# Altium schematic sheet P01_Top Level.SchDoc
size C; SheetNumber: 1; SheetTotal: 3
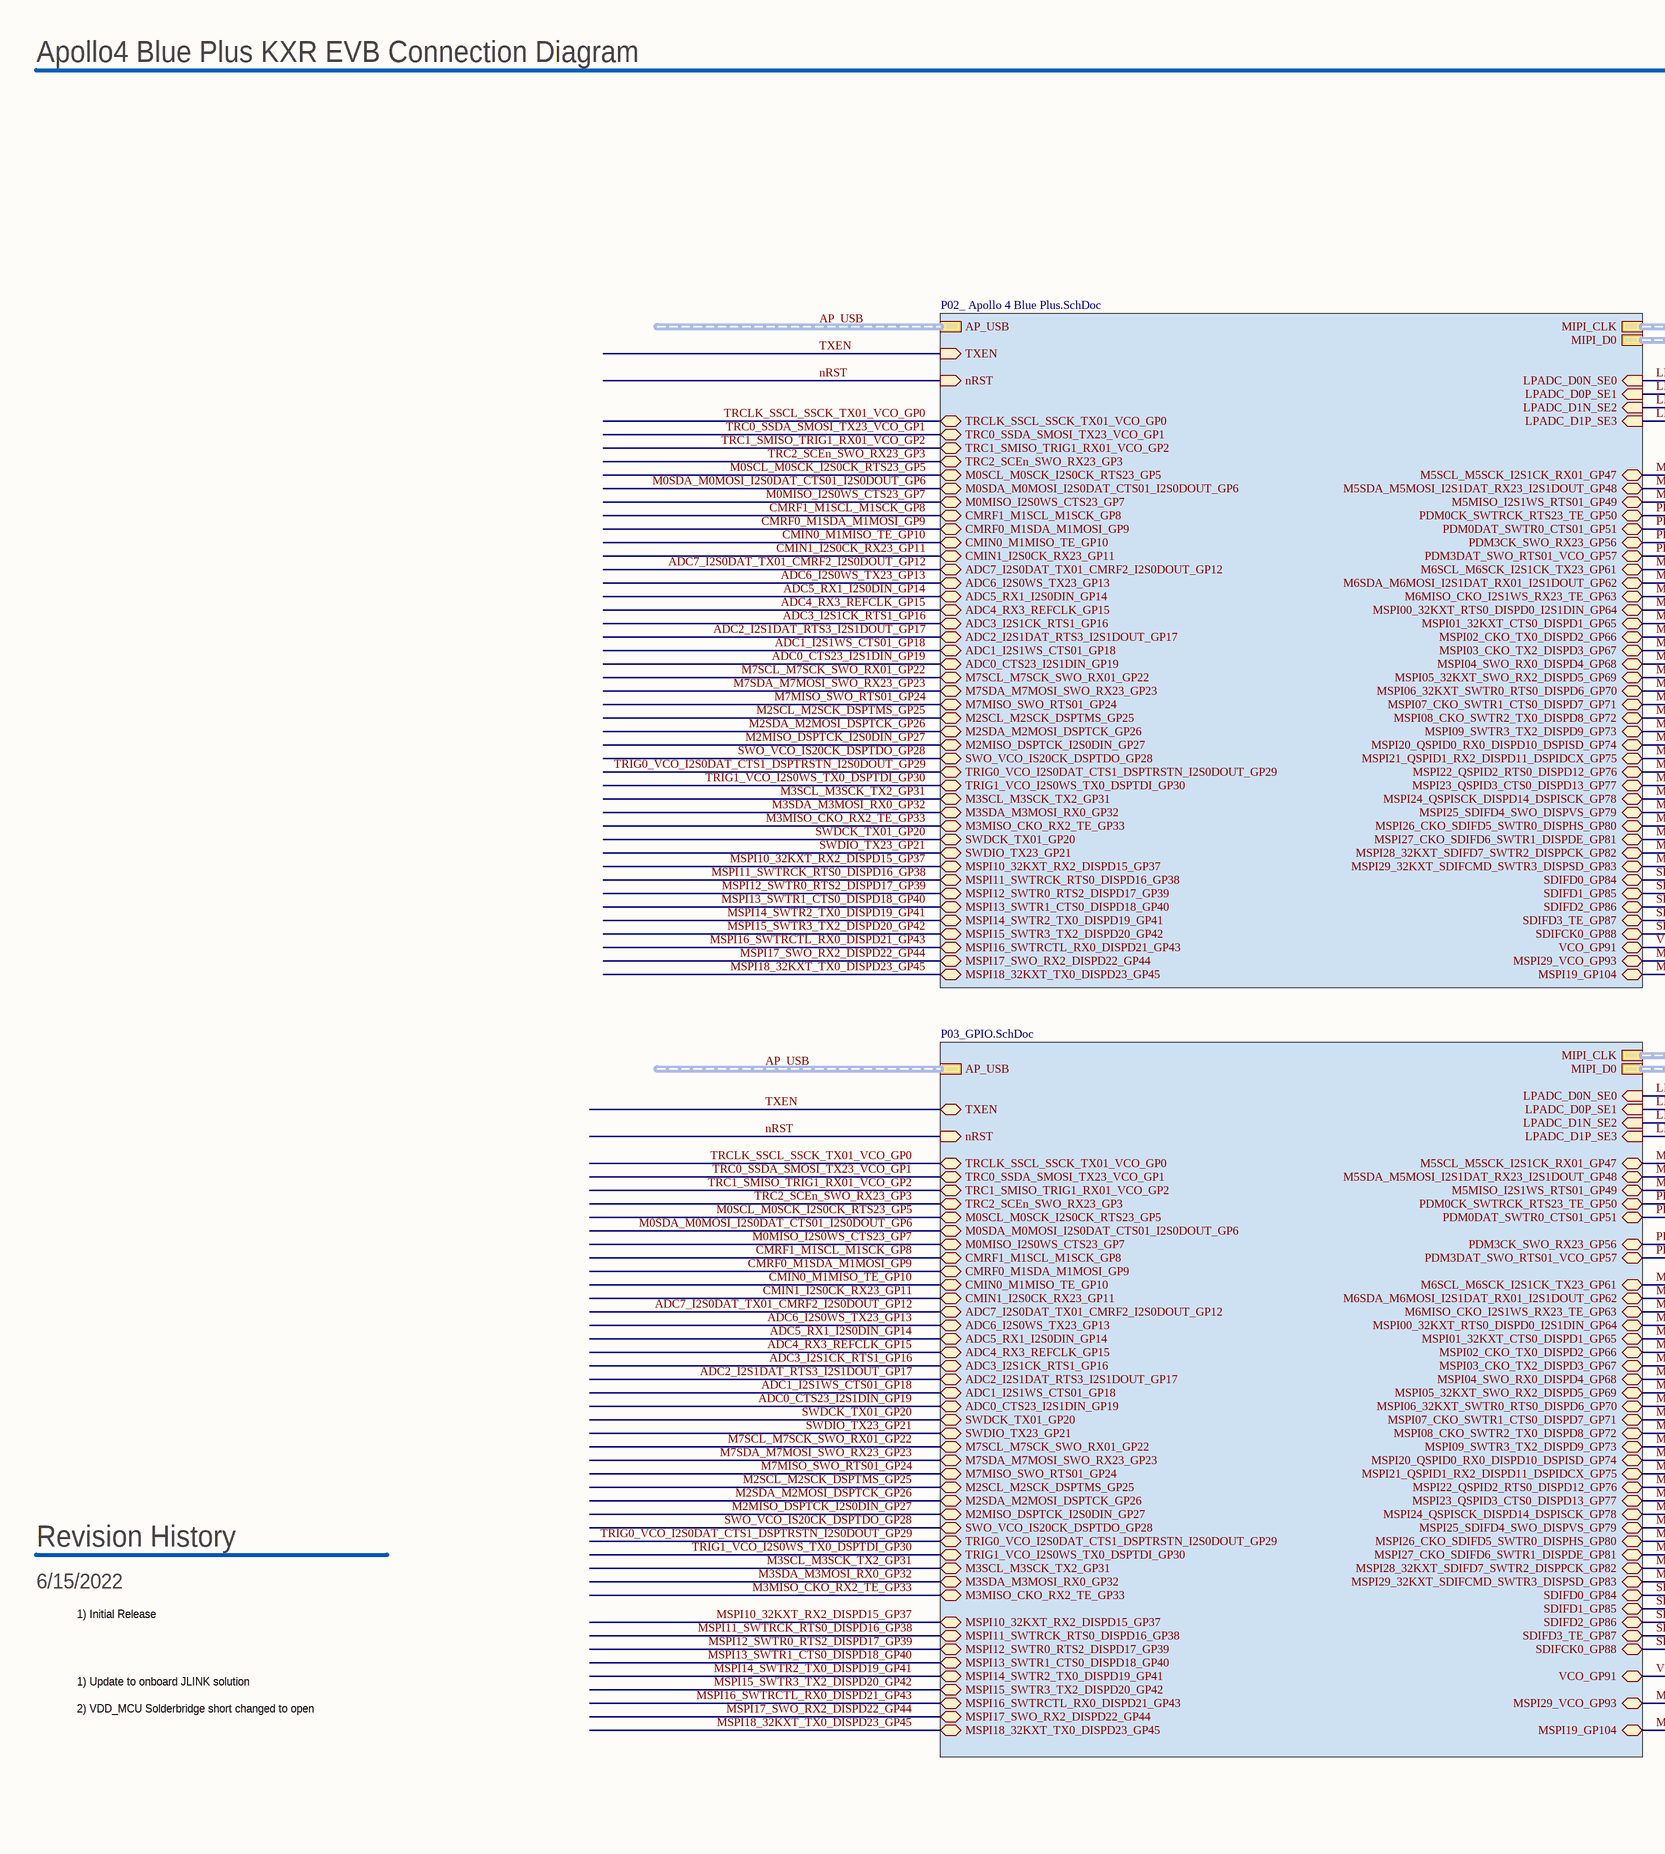
[diagram p0: P01_Top Level.SchDoc, left]
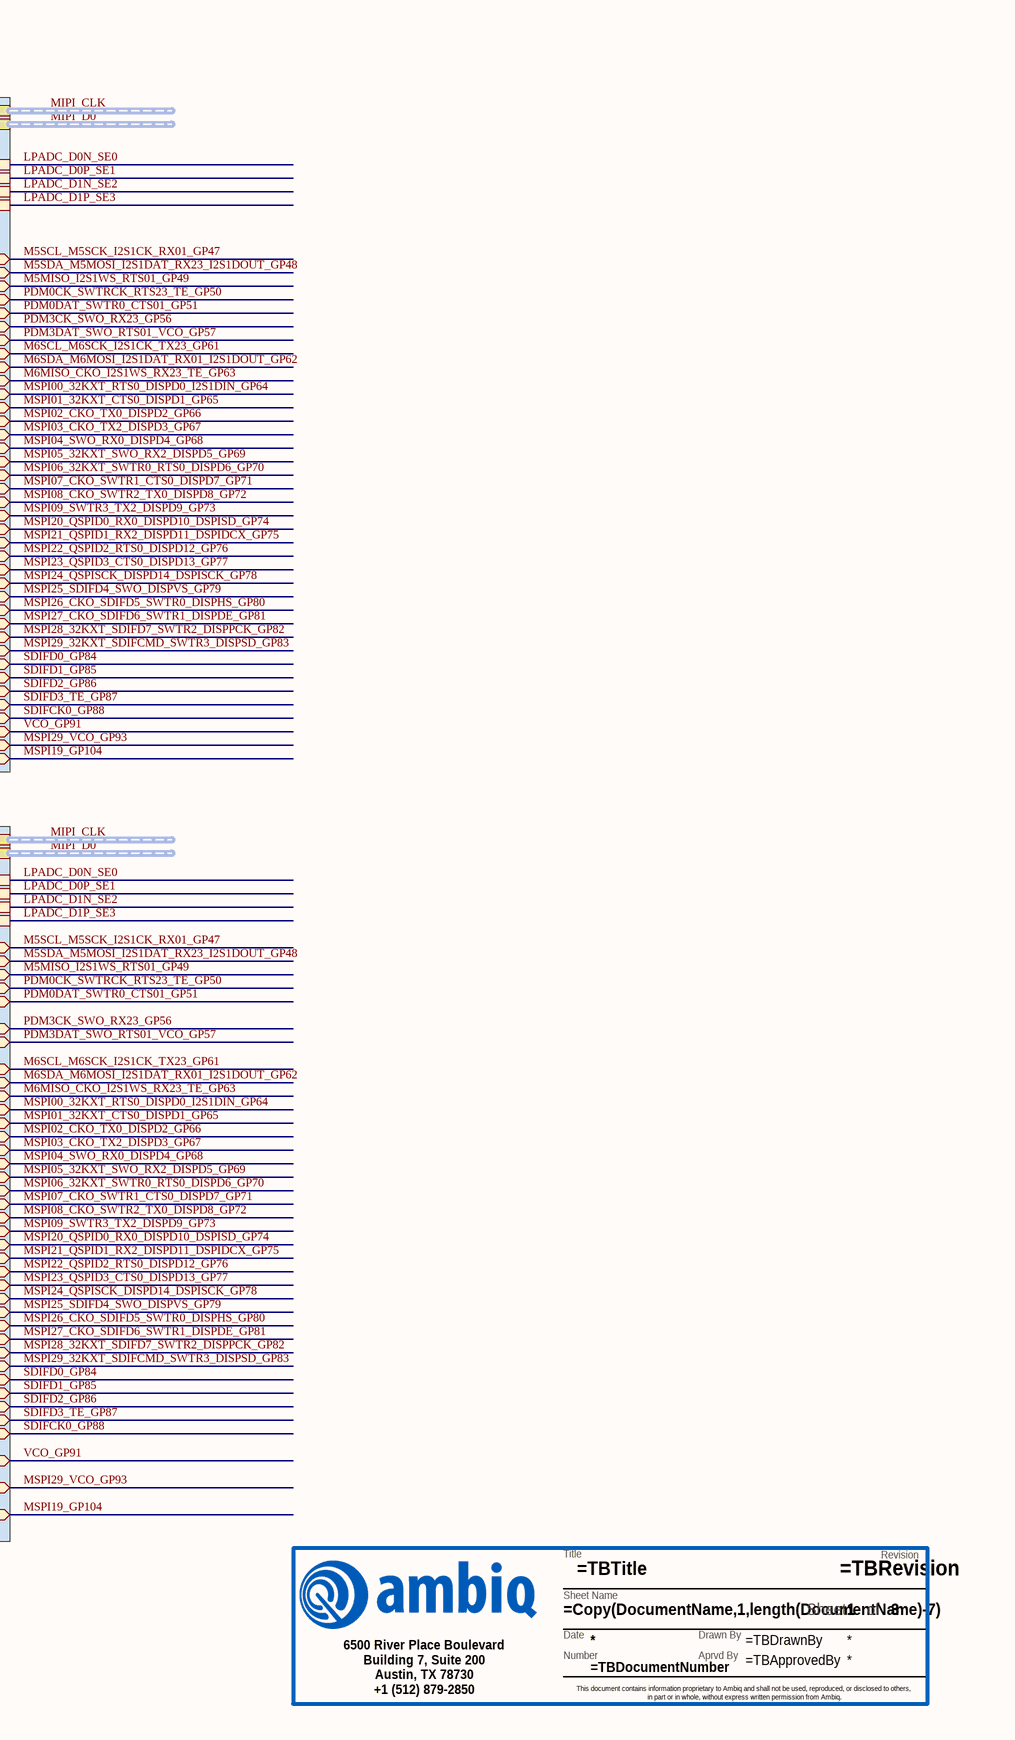
[diagram p1: P01_Top Level.SchDoc, right]

## Parts
?  TitleBlock  (value not drawn)  (graphical)

## Sub-sheets
Apollo4B = P02_ Apollo 4 Blue Plus.SchDoc: LPADC_D0P_SE1 (in), LPADC_D0N_SE0 (in), LPADC_D1P_SE3 (in), LPADC_D1N_SE2 (in), MIPI_CLK (harness MIPI), MIPI_D0 (harness MIPI), TRCLK_SSCL_SSCK_TX01_VCO_GP0 (bidir), TRC0_SSDA_SMOSI_TX23_VCO_GP1 (bidir), TRC1_SMISO_TRIG1_RX01_VCO_GP2 (bidir), TRC2_SCEn_SWO_RX23_GP3 (bidir), M0SCL_M0SCK_I2S0CK_RTS23_GP5 (bidir), M0SDA_M0MOSI_I2S0DAT_CTS01_I2S0DOUT_GP6 (bidir), M0MISO_I2S0WS_CTS23_GP7 (bidir), CMRF1_M1SCL_M1SCK_GP8 (bidir), CMRF0_M1SDA_M1MOSI_GP9 (bidir), CMIN0_M1MISO_TE_GP10 (bidir), CMIN1_I2S0CK_RX23_GP11 (bidir), ADC7_I2S0DAT_TX01_CMRF2_I2S0DOUT_GP12 (bidir), ADC6_I2S0WS_TX23_GP13 (bidir), ADC5_RX1_I2S0DIN_GP14 (bidir), ADC4_RX3_REFCLK_GP15 (bidir), ADC3_I2S1CK_RTS1_GP16 (bidir), ADC2_I2S1DAT_RTS3_I2S1DOUT_GP17 (bidir), ADC1_I2S1WS_CTS01_GP18 (bidir), ADC0_CTS23_I2S1DIN_GP19 (bidir), M7SCL_M7SCK_SWO_RX01_GP22 (bidir), M7SDA_M7MOSI_SWO_RX23_GP23 (bidir), M7MISO_SWO_RTS01_GP24 (bidir), M2SCL_M2SCK_DSPTMS_GP25 (bidir), M2SDA_M2MOSI_DSPTCK_GP26 (bidir), M2MISO_DSPTCK_I2S0DIN_GP27 (bidir), SWO_VCO_IS20CK_DSPTDO_GP28 (bidir), TRIG0_VCO_I2S0DAT_CTS1_DSPTRSTN_I2S0DOUT_GP29 (bidir), TRIG1_VCO_I2S0WS_TX0_DSPTDI_GP30 (bidir), M3SCL_M3SCK_TX2_GP31 (bidir), M3SDA_M3MOSI_RX0_GP32 (bidir), M3MISO_CKO_RX2_TE_GP33 (bidir), SWDCK_TX01_GP20 (bidir), SWDIO_TX23_GP21 (bidir), MSPI10_32KXT_RX2_DISPD15_GP37 (bidir), MSPI11_SWTRCK_RTS0_DISPD16_GP38 (bidir), MSPI12_SWTR0_RTS2_DISPD17_GP39 (bidir), MSPI13_SWTR1_CTS0_DISPD18_GP40 (bidir), MSPI14_SWTR2_TX0_DISPD19_GP41 (bidir), MSPI15_SWTR3_TX2_DISPD20_GP42 (bidir), MSPI16_SWTRCTL_RX0_DISPD21_GP43 (bidir), MSPI17_SWO_RX2_DISPD22_GP44 (bidir), MSPI18_32KXT_TX0_DISPD23_GP45 (bidir), MSPI27_CKO_SDIFD6_SWTR1_DISPDE_GP81 (bidir), MSPI28_32KXT_SDIFD7_SWTR2_DISPPCK_GP82 (bidir), MSPI29_32KXT_SDIFCMD_SWTR3_DISPSD_GP83 (bidir), SDIFD0_GP84 (bidir), SDIFD1_GP85 (bidir), SDIFD2_GP86 (bidir), SDIFD3_TE_GP87 (bidir), SDIFCK0_GP88 (bidir), VCO_GP91 (bidir), MSPI29_VCO_GP93 (bidir), MSPI19_GP104 (bidir), MSPI00_32KXT_RTS0_DISPD0_I2S1DIN_GP64 (bidir), MSPI01_32KXT_CTS0_DISPD1_GP65 (bidir), MSPI02_CKO_TX0_DISPD2_GP66 (bidir), MSPI03_CKO_TX2_DISPD3_GP67 (bidir), MSPI04_SWO_RX0_DISPD4_GP68 (bidir), MSPI05_32KXT_SWO_RX2_DISPD5_GP69 (bidir), MSPI06_32KXT_SWTR0_RTS0_DISPD6_GP70 (bidir), MSPI07_CKO_SWTR1_CTS0_DISPD7_GP71 (bidir), MSPI08_CKO_SWTR2_TX0_DISPD8_GP72 (bidir), MSPI09_SWTR3_TX2_DISPD9_GP73 (bidir), MSPI20_QSPID0_RX0_DISPD10_DSPISD_GP74 (bidir), MSPI21_QSPID1_RX2_DISPD11_DSPIDCX_GP75 (bidir), MSPI22_QSPID2_RTS0_DISPD12_GP76 (bidir), MSPI23_QSPID3_CTS0_DISPD13_GP77 (bidir), MSPI24_QSPISCK_DISPD14_DSPISCK_GP78 (bidir), MSPI25_SDIFD4_SWO_DISPVS_GP79 (bidir), MSPI26_CKO_SDIFD5_SWTR0_DISPHS_GP80 (bidir), M5SCL_M5SCK_I2S1CK_RX01_GP47 (bidir), M5SDA_M5MOSI_I2S1DAT_RX23_I2S1DOUT_GP48 (bidir), M5MISO_I2S1WS_RTS01_GP49 (bidir), PDM0CK_SWTRCK_RTS23_TE_GP50 (bidir), PDM0DAT_SWTR0_CTS01_GP51 (bidir), PDM3CK_SWO_RX23_GP56 (bidir), PDM3DAT_SWO_RTS01_VCO_GP57 (bidir), M6SCL_M6SCK_I2S1CK_TX23_GP61 (bidir), M6SDA_M6MOSI_I2S1DAT_RX01_I2S1DOUT_GP62 (bidir), M6MISO_CKO_I2S1WS_RX23_TE_GP63 (bidir), AP_USB (harness USB), TXEN (in), nRST (in)
GPIO = P03_GPIO.SchDoc: MIPI_CLK (harness MIPI), MIPI_D0 (harness MIPI), M0SCL_M0SCK_I2S0CK_RTS23_GP5 (bidir), M0SDA_M0MOSI_I2S0DAT_CTS01_I2S0DOUT_GP6 (bidir), M0MISO_I2S0WS_CTS23_GP7 (bidir), CMRF1_M1SCL_M1SCK_GP8 (bidir), CMRF0_M1SDA_M1MOSI_GP9 (bidir), CMIN0_M1MISO_TE_GP10 (bidir), CMIN1_I2S0CK_RX23_GP11 (bidir), ADC7_I2S0DAT_TX01_CMRF2_I2S0DOUT_GP12 (bidir), ADC6_I2S0WS_TX23_GP13 (bidir), ADC5_RX1_I2S0DIN_GP14 (bidir), ADC4_RX3_REFCLK_GP15 (bidir), ADC3_I2S1CK_RTS1_GP16 (bidir), ADC2_I2S1DAT_RTS3_I2S1DOUT_GP17 (bidir), ADC1_I2S1WS_CTS01_GP18 (bidir), ADC0_CTS23_I2S1DIN_GP19 (bidir), M7SCL_M7SCK_SWO_RX01_GP22 (bidir), M7SDA_M7MOSI_SWO_RX23_GP23 (bidir), M7MISO_SWO_RTS01_GP24 (bidir), M2SCL_M2SCK_DSPTMS_GP25 (bidir), M2SDA_M2MOSI_DSPTCK_GP26 (bidir), M2MISO_DSPTCK_I2S0DIN_GP27 (bidir), SWO_VCO_IS20CK_DSPTDO_GP28 (bidir), TRIG0_VCO_I2S0DAT_CTS1_DSPTRSTN_I2S0DOUT_GP29 (bidir), TRIG1_VCO_I2S0WS_TX0_DSPTDI_GP30 (bidir), M3SCL_M3SCK_TX2_GP31 (bidir), M3SDA_M3MOSI_RX0_GP32 (bidir), M3MISO_CKO_RX2_TE_GP33 (bidir), MSPI10_32KXT_RX2_DISPD15_GP37 (bidir), MSPI11_SWTRCK_RTS0_DISPD16_GP38 (bidir), MSPI12_SWTR0_RTS2_DISPD17_GP39 (bidir), MSPI13_SWTR1_CTS0_DISPD18_GP40 (bidir), MSPI14_SWTR2_TX0_DISPD19_GP41 (bidir), MSPI15_SWTR3_TX2_DISPD20_GP42 (bidir), MSPI16_SWTRCTL_RX0_DISPD21_GP43 (bidir), MSPI17_SWO_RX2_DISPD22_GP44 (bidir), MSPI18_32KXT_TX0_DISPD23_GP45 (bidir), MSPI27_CKO_SDIFD6_SWTR1_DISPDE_GP81 (bidir), MSPI28_32KXT_SDIFD7_SWTR2_DISPPCK_GP82 (bidir), MSPI29_32KXT_SDIFCMD_SWTR3_DISPSD_GP83 (bidir), SDIFD0_GP84 (bidir), SDIFD1_GP85 (bidir), SDIFD2_GP86 (bidir), SDIFD3_TE_GP87 (bidir), SDIFCK0_GP88 (bidir), VCO_GP91 (bidir), MSPI29_VCO_GP93 (bidir), MSPI19_GP104 (bidir), MSPI00_32KXT_RTS0_DISPD0_I2S1DIN_GP64 (bidir), MSPI01_32KXT_CTS0_DISPD1_GP65 (bidir), MSPI02_CKO_TX0_DISPD2_GP66 (bidir), MSPI03_CKO_TX2_DISPD3_GP67 (bidir), MSPI04_SWO_RX0_DISPD4_GP68 (bidir), MSPI05_32KXT_SWO_RX2_DISPD5_GP69 (bidir), MSPI06_32KXT_SWTR0_RTS0_DISPD6_GP70 (bidir), MSPI07_CKO_SWTR1_CTS0_DISPD7_GP71 (bidir), MSPI08_CKO_SWTR2_TX0_DISPD8_GP72 (bidir), MSPI09_SWTR3_TX2_DISPD9_GP73 (bidir), MSPI20_QSPID0_RX0_DISPD10_DSPISD_GP74 (bidir), MSPI21_QSPID1_RX2_DISPD11_DSPIDCX_GP75 (bidir), MSPI22_QSPID2_RTS0_DISPD12_GP76 (bidir), MSPI23_QSPID3_CTS0_DISPD13_GP77 (bidir), MSPI24_QSPISCK_DISPD14_DSPISCK_GP78 (bidir), MSPI25_SDIFD4_SWO_DISPVS_GP79 (bidir), MSPI26_CKO_SDIFD5_SWTR0_DISPHS_GP80 (bidir), M5SCL_M5SCK_I2S1CK_RX01_GP47 (bidir), M5SDA_M5MOSI_I2S1DAT_RX23_I2S1DOUT_GP48 (bidir), M5MISO_I2S1WS_RTS01_GP49 (bidir), PDM0CK_SWTRCK_RTS23_TE_GP50 (bidir), PDM0DAT_SWTR0_CTS01_GP51 (bidir), PDM3CK_SWO_RX23_GP56 (bidir), PDM3DAT_SWO_RTS01_VCO_GP57 (bidir), M6SCL_M6SCK_I2S1CK_TX23_GP61 (bidir), M6SDA_M6MOSI_I2S1DAT_RX01_I2S1DOUT_GP62 (bidir), M6MISO_CKO_I2S1WS_RX23_TE_GP63 (bidir), TXEN (bidir), TRCLK_SSCL_SSCK_TX01_VCO_GP0 (bidir), TRC1_SMISO_TRIG1_RX01_VCO_GP2 (bidir), TRC2_SCEn_SWO_RX23_GP3 (bidir), nRST (in), TRC0_SSDA_SMOSI_TX23_VCO_GP1 (bidir), SWDCK_TX01_GP20 (bidir), SWDIO_TX23_GP21 (bidir), AP_USB (harness USB), LPADC_D0P_SE1 (in), LPADC_D0N_SE0 (in), LPADC_D1P_SE3 (in), LPADC_D1N_SE2 (in)

## Nets
ADC0_CTS23_I2S1DIN_GP19: sheet Apollo4B/ADC0_CTS23_I2S1DIN_GP19, sheet GPIO/ADC0_CTS23_I2S1DIN_GP19
ADC1_I2S1WS_CTS01_GP18: sheet Apollo4B/ADC1_I2S1WS_CTS01_GP18, sheet GPIO/ADC1_I2S1WS_CTS01_GP18
ADC2_I2S1DAT_RTS3_I2S1DOUT_GP17: sheet Apollo4B/ADC2_I2S1DAT_RTS3_I2S1DOUT_GP17, sheet GPIO/ADC2_I2S1DAT_RTS3_I2S1DOUT_GP17
ADC3_I2S1CK_RTS1_GP16: sheet Apollo4B/ADC3_I2S1CK_RTS1_GP16, sheet GPIO/ADC3_I2S1CK_RTS1_GP16
ADC4_RX3_REFCLK_GP15: sheet Apollo4B/ADC4_RX3_REFCLK_GP15, sheet GPIO/ADC4_RX3_REFCLK_GP15
ADC5_RX1_I2S0DIN_GP14: sheet Apollo4B/ADC5_RX1_I2S0DIN_GP14, sheet GPIO/ADC5_RX1_I2S0DIN_GP14
ADC6_I2S0WS_TX23_GP13: sheet Apollo4B/ADC6_I2S0WS_TX23_GP13, sheet GPIO/ADC6_I2S0WS_TX23_GP13
ADC7_I2S0DAT_TX01_CMRF2_I2S0DOUT_GP12: sheet Apollo4B/ADC7_I2S0DAT_TX01_CMRF2_I2S0DOUT_GP12, sheet GPIO/ADC7_I2S0DAT_TX01_CMRF2_I2S0DOUT_GP12
CMIN0_M1MISO_TE_GP10: sheet Apollo4B/CMIN0_M1MISO_TE_GP10, sheet GPIO/CMIN0_M1MISO_TE_GP10
CMIN1_I2S0CK_RX23_GP11: sheet Apollo4B/CMIN1_I2S0CK_RX23_GP11, sheet GPIO/CMIN1_I2S0CK_RX23_GP11
CMRF0_M1SDA_M1MOSI_GP9: sheet Apollo4B/CMRF0_M1SDA_M1MOSI_GP9, sheet GPIO/CMRF0_M1SDA_M1MOSI_GP9
CMRF1_M1SCL_M1SCK_GP8: sheet Apollo4B/CMRF1_M1SCL_M1SCK_GP8, sheet GPIO/CMRF1_M1SCL_M1SCK_GP8
LPADC_D0N_SE0: sheet Apollo4B/LPADC_D0N_SE0, sheet GPIO/LPADC_D0N_SE0
LPADC_D0P_SE1: sheet Apollo4B/LPADC_D0P_SE1, sheet GPIO/LPADC_D0P_SE1
LPADC_D1N_SE2: sheet Apollo4B/LPADC_D1N_SE2, sheet GPIO/LPADC_D1N_SE2
LPADC_D1P_SE3: sheet Apollo4B/LPADC_D1P_SE3, sheet GPIO/LPADC_D1P_SE3
M0MISO_I2S0WS_CTS23_GP7: sheet Apollo4B/M0MISO_I2S0WS_CTS23_GP7, sheet GPIO/M0MISO_I2S0WS_CTS23_GP7
M0SCL_M0SCK_I2S0CK_RTS23_GP5: sheet Apollo4B/M0SCL_M0SCK_I2S0CK_RTS23_GP5, sheet GPIO/M0SCL_M0SCK_I2S0CK_RTS23_GP5
M0SDA_M0MOSI_I2S0DAT_CTS01_I2S0DOUT_GP6: sheet Apollo4B/M0SDA_M0MOSI_I2S0DAT_CTS01_I2S0DOUT_GP6, sheet GPIO/M0SDA_M0MOSI_I2S0DAT_CTS01_I2S0DOUT_GP6
M2MISO_DSPTCK_I2S0DIN_GP27: sheet Apollo4B/M2MISO_DSPTCK_I2S0DIN_GP27, sheet GPIO/M2MISO_DSPTCK_I2S0DIN_GP27
M2SCL_M2SCK_DSPTMS_GP25: sheet Apollo4B/M2SCL_M2SCK_DSPTMS_GP25, sheet GPIO/M2SCL_M2SCK_DSPTMS_GP25
M2SDA_M2MOSI_DSPTCK_GP26: sheet Apollo4B/M2SDA_M2MOSI_DSPTCK_GP26, sheet GPIO/M2SDA_M2MOSI_DSPTCK_GP26
M3MISO_CKO_RX2_TE_GP33: sheet Apollo4B/M3MISO_CKO_RX2_TE_GP33, sheet GPIO/M3MISO_CKO_RX2_TE_GP33
M3SCL_M3SCK_TX2_GP31: sheet Apollo4B/M3SCL_M3SCK_TX2_GP31, sheet GPIO/M3SCL_M3SCK_TX2_GP31
M3SDA_M3MOSI_RX0_GP32: sheet Apollo4B/M3SDA_M3MOSI_RX0_GP32, sheet GPIO/M3SDA_M3MOSI_RX0_GP32
M5MISO_I2S1WS_RTS01_GP49: sheet Apollo4B/M5MISO_I2S1WS_RTS01_GP49, sheet GPIO/M5MISO_I2S1WS_RTS01_GP49
M5SCL_M5SCK_I2S1CK_RX01_GP47: sheet Apollo4B/M5SCL_M5SCK_I2S1CK_RX01_GP47, sheet GPIO/M5SCL_M5SCK_I2S1CK_RX01_GP47
M5SDA_M5MOSI_I2S1DAT_RX23_I2S1DOUT_GP48: sheet Apollo4B/M5SDA_M5MOSI_I2S1DAT_RX23_I2S1DOUT_GP48, sheet GPIO/M5SDA_M5MOSI_I2S1DAT_RX23_I2S1DOUT_GP48
M6MISO_CKO_I2S1WS_RX23_TE_GP63: sheet Apollo4B/M6MISO_CKO_I2S1WS_RX23_TE_GP63, sheet GPIO/M6MISO_CKO_I2S1WS_RX23_TE_GP63
M6SCL_M6SCK_I2S1CK_TX23_GP61: sheet Apollo4B/M6SCL_M6SCK_I2S1CK_TX23_GP61, sheet GPIO/M6SCL_M6SCK_I2S1CK_TX23_GP61
M6SDA_M6MOSI_I2S1DAT_RX01_I2S1DOUT_GP62: sheet Apollo4B/M6SDA_M6MOSI_I2S1DAT_RX01_I2S1DOUT_GP62, sheet GPIO/M6SDA_M6MOSI_I2S1DAT_RX01_I2S1DOUT_GP62
M7MISO_SWO_RTS01_GP24: sheet Apollo4B/M7MISO_SWO_RTS01_GP24, sheet GPIO/M7MISO_SWO_RTS01_GP24
M7SCL_M7SCK_SWO_RX01_GP22: sheet Apollo4B/M7SCL_M7SCK_SWO_RX01_GP22, sheet GPIO/M7SCL_M7SCK_SWO_RX01_GP22
M7SDA_M7MOSI_SWO_RX23_GP23: sheet Apollo4B/M7SDA_M7MOSI_SWO_RX23_GP23, sheet GPIO/M7SDA_M7MOSI_SWO_RX23_GP23
MSPI00_32KXT_RTS0_DISPD0_I2S1DIN_GP64: sheet Apollo4B/MSPI00_32KXT_RTS0_DISPD0_I2S1DIN_GP64, sheet GPIO/MSPI00_32KXT_RTS0_DISPD0_I2S1DIN_GP64
MSPI01_32KXT_CTS0_DISPD1_GP65: sheet Apollo4B/MSPI01_32KXT_CTS0_DISPD1_GP65, sheet GPIO/MSPI01_32KXT_CTS0_DISPD1_GP65
MSPI02_CKO_TX0_DISPD2_GP66: sheet Apollo4B/MSPI02_CKO_TX0_DISPD2_GP66, sheet GPIO/MSPI02_CKO_TX0_DISPD2_GP66
MSPI03_CKO_TX2_DISPD3_GP67: sheet Apollo4B/MSPI03_CKO_TX2_DISPD3_GP67, sheet GPIO/MSPI03_CKO_TX2_DISPD3_GP67
MSPI04_SWO_RX0_DISPD4_GP68: sheet Apollo4B/MSPI04_SWO_RX0_DISPD4_GP68, sheet GPIO/MSPI04_SWO_RX0_DISPD4_GP68
MSPI05_32KXT_SWO_RX2_DISPD5_GP69: sheet Apollo4B/MSPI05_32KXT_SWO_RX2_DISPD5_GP69, sheet GPIO/MSPI05_32KXT_SWO_RX2_DISPD5_GP69
MSPI06_32KXT_SWTR0_RTS0_DISPD6_GP70: sheet Apollo4B/MSPI06_32KXT_SWTR0_RTS0_DISPD6_GP70, sheet GPIO/MSPI06_32KXT_SWTR0_RTS0_DISPD6_GP70
MSPI07_CKO_SWTR1_CTS0_DISPD7_GP71: sheet Apollo4B/MSPI07_CKO_SWTR1_CTS0_DISPD7_GP71, sheet GPIO/MSPI07_CKO_SWTR1_CTS0_DISPD7_GP71
MSPI08_CKO_SWTR2_TX0_DISPD8_GP72: sheet Apollo4B/MSPI08_CKO_SWTR2_TX0_DISPD8_GP72, sheet GPIO/MSPI08_CKO_SWTR2_TX0_DISPD8_GP72
MSPI09_SWTR3_TX2_DISPD9_GP73: sheet Apollo4B/MSPI09_SWTR3_TX2_DISPD9_GP73, sheet GPIO/MSPI09_SWTR3_TX2_DISPD9_GP73
MSPI10_32KXT_RX2_DISPD15_GP37: sheet Apollo4B/MSPI10_32KXT_RX2_DISPD15_GP37, sheet GPIO/MSPI10_32KXT_RX2_DISPD15_GP37
MSPI11_SWTRCK_RTS0_DISPD16_GP38: sheet Apollo4B/MSPI11_SWTRCK_RTS0_DISPD16_GP38, sheet GPIO/MSPI11_SWTRCK_RTS0_DISPD16_GP38
MSPI12_SWTR0_RTS2_DISPD17_GP39: sheet Apollo4B/MSPI12_SWTR0_RTS2_DISPD17_GP39, sheet GPIO/MSPI12_SWTR0_RTS2_DISPD17_GP39
MSPI13_SWTR1_CTS0_DISPD18_GP40: sheet Apollo4B/MSPI13_SWTR1_CTS0_DISPD18_GP40, sheet GPIO/MSPI13_SWTR1_CTS0_DISPD18_GP40
MSPI14_SWTR2_TX0_DISPD19_GP41: sheet Apollo4B/MSPI14_SWTR2_TX0_DISPD19_GP41, sheet GPIO/MSPI14_SWTR2_TX0_DISPD19_GP41
MSPI15_SWTR3_TX2_DISPD20_GP42: sheet Apollo4B/MSPI15_SWTR3_TX2_DISPD20_GP42, sheet GPIO/MSPI15_SWTR3_TX2_DISPD20_GP42
MSPI16_SWTRCTL_RX0_DISPD21_GP43: sheet Apollo4B/MSPI16_SWTRCTL_RX0_DISPD21_GP43, sheet GPIO/MSPI16_SWTRCTL_RX0_DISPD21_GP43
MSPI17_SWO_RX2_DISPD22_GP44: sheet Apollo4B/MSPI17_SWO_RX2_DISPD22_GP44, sheet GPIO/MSPI17_SWO_RX2_DISPD22_GP44
MSPI18_32KXT_TX0_DISPD23_GP45: sheet Apollo4B/MSPI18_32KXT_TX0_DISPD23_GP45, sheet GPIO/MSPI18_32KXT_TX0_DISPD23_GP45
MSPI19_GP104: sheet Apollo4B/MSPI19_GP104, sheet GPIO/MSPI19_GP104
MSPI20_QSPID0_RX0_DISPD10_DSPISD_GP74: sheet Apollo4B/MSPI20_QSPID0_RX0_DISPD10_DSPISD_GP74, sheet GPIO/MSPI20_QSPID0_RX0_DISPD10_DSPISD_GP74
MSPI21_QSPID1_RX2_DISPD11_DSPIDCX_GP75: sheet Apollo4B/MSPI21_QSPID1_RX2_DISPD11_DSPIDCX_GP75, sheet GPIO/MSPI21_QSPID1_RX2_DISPD11_DSPIDCX_GP75
MSPI22_QSPID2_RTS0_DISPD12_GP76: sheet Apollo4B/MSPI22_QSPID2_RTS0_DISPD12_GP76, sheet GPIO/MSPI22_QSPID2_RTS0_DISPD12_GP76
MSPI23_QSPID3_CTS0_DISPD13_GP77: sheet Apollo4B/MSPI23_QSPID3_CTS0_DISPD13_GP77, sheet GPIO/MSPI23_QSPID3_CTS0_DISPD13_GP77
MSPI24_QSPISCK_DISPD14_DSPISCK_GP78: sheet Apollo4B/MSPI24_QSPISCK_DISPD14_DSPISCK_GP78, sheet GPIO/MSPI24_QSPISCK_DISPD14_DSPISCK_GP78
MSPI25_SDIFD4_SWO_DISPVS_GP79: sheet Apollo4B/MSPI25_SDIFD4_SWO_DISPVS_GP79, sheet GPIO/MSPI25_SDIFD4_SWO_DISPVS_GP79
MSPI26_CKO_SDIFD5_SWTR0_DISPHS_GP80: sheet Apollo4B/MSPI26_CKO_SDIFD5_SWTR0_DISPHS_GP80, sheet GPIO/MSPI26_CKO_SDIFD5_SWTR0_DISPHS_GP80
MSPI27_CKO_SDIFD6_SWTR1_DISPDE_GP81: sheet Apollo4B/MSPI27_CKO_SDIFD6_SWTR1_DISPDE_GP81, sheet GPIO/MSPI27_CKO_SDIFD6_SWTR1_DISPDE_GP81
MSPI28_32KXT_SDIFD7_SWTR2_DISPPCK_GP82: sheet Apollo4B/MSPI28_32KXT_SDIFD7_SWTR2_DISPPCK_GP82, sheet GPIO/MSPI28_32KXT_SDIFD7_SWTR2_DISPPCK_GP82
MSPI29_32KXT_SDIFCMD_SWTR3_DISPSD_GP83: sheet Apollo4B/MSPI29_32KXT_SDIFCMD_SWTR3_DISPSD_GP83, sheet GPIO/MSPI29_32KXT_SDIFCMD_SWTR3_DISPSD_GP83
MSPI29_VCO_GP93: sheet Apollo4B/MSPI29_VCO_GP93, sheet GPIO/MSPI29_VCO_GP93
nRST: sheet Apollo4B/nRST, sheet GPIO/nRST
PDM0CK_SWTRCK_RTS23_TE_GP50: sheet Apollo4B/PDM0CK_SWTRCK_RTS23_TE_GP50, sheet GPIO/PDM0CK_SWTRCK_RTS23_TE_GP50
PDM0DAT_SWTR0_CTS01_GP51: sheet Apollo4B/PDM0DAT_SWTR0_CTS01_GP51, sheet GPIO/PDM0DAT_SWTR0_CTS01_GP51
PDM3CK_SWO_RX23_GP56: sheet Apollo4B/PDM3CK_SWO_RX23_GP56, sheet GPIO/PDM3CK_SWO_RX23_GP56
PDM3DAT_SWO_RTS01_VCO_GP57: sheet Apollo4B/PDM3DAT_SWO_RTS01_VCO_GP57, sheet GPIO/PDM3DAT_SWO_RTS01_VCO_GP57
SDIFCK0_GP88: sheet Apollo4B/SDIFCK0_GP88, sheet GPIO/SDIFCK0_GP88
SDIFD0_GP84: sheet Apollo4B/SDIFD0_GP84, sheet GPIO/SDIFD0_GP84
SDIFD1_GP85: sheet Apollo4B/SDIFD1_GP85, sheet GPIO/SDIFD1_GP85
SDIFD2_GP86: sheet Apollo4B/SDIFD2_GP86, sheet GPIO/SDIFD2_GP86
SDIFD3_TE_GP87: sheet Apollo4B/SDIFD3_TE_GP87, sheet GPIO/SDIFD3_TE_GP87
SWDCK_TX01_GP20: sheet Apollo4B/SWDCK_TX01_GP20, sheet GPIO/SWDCK_TX01_GP20
SWDIO_TX23_GP21: sheet Apollo4B/SWDIO_TX23_GP21, sheet GPIO/SWDIO_TX23_GP21
SWO_VCO_IS20CK_DSPTDO_GP28: sheet Apollo4B/SWO_VCO_IS20CK_DSPTDO_GP28, sheet GPIO/SWO_VCO_IS20CK_DSPTDO_GP28
TRC0_SSDA_SMOSI_TX23_VCO_GP1: sheet Apollo4B/TRC0_SSDA_SMOSI_TX23_VCO_GP1, sheet GPIO/TRC0_SSDA_SMOSI_TX23_VCO_GP1
TRC1_SMISO_TRIG1_RX01_VCO_GP2: sheet Apollo4B/TRC1_SMISO_TRIG1_RX01_VCO_GP2, sheet GPIO/TRC1_SMISO_TRIG1_RX01_VCO_GP2
TRC2_SCEn_SWO_RX23_GP3: sheet Apollo4B/TRC2_SCEn_SWO_RX23_GP3, sheet GPIO/TRC2_SCEn_SWO_RX23_GP3
TRCLK_SSCL_SSCK_TX01_VCO_GP0: sheet Apollo4B/TRCLK_SSCL_SSCK_TX01_VCO_GP0, sheet GPIO/TRCLK_SSCL_SSCK_TX01_VCO_GP0
TRIG0_VCO_I2S0DAT_CTS1_DSPTRSTN_I2S0DOUT_GP29: sheet Apollo4B/TRIG0_VCO_I2S0DAT_CTS1_DSPTRSTN_I2S0DOUT_GP29, sheet GPIO/TRIG0_VCO_I2S0DAT_CTS1_DSPTRSTN_I2S0DOUT_GP29
TRIG1_VCO_I2S0WS_TX0_DSPTDI_GP30: sheet Apollo4B/TRIG1_VCO_I2S0WS_TX0_DSPTDI_GP30, sheet GPIO/TRIG1_VCO_I2S0WS_TX0_DSPTDI_GP30
TXEN: sheet Apollo4B/TXEN, sheet GPIO/TXEN
VCO_GP91: sheet Apollo4B/VCO_GP91, sheet GPIO/VCO_GP91

## Buses and harness runs
harness AP_USB = sheet Apollo4B/AP_USB
harness AP_USB = sheet GPIO/AP_USB
harness MIPI_CLK = sheet Apollo4B/MIPI_CLK
harness MIPI_CLK = sheet GPIO/MIPI_CLK
harness MIPI_D0 = sheet Apollo4B/MIPI_D0
harness MIPI_D0 = sheet GPIO/MIPI_D0

## Notes on the sheet
- Apollo4 Blue Plus KXR EVB Connection Diagram
- Revision History
- 6/15/2022
- 1) Initial Release
- 1) Update to onboard JLINK solution
- 2) VDD_MCU Solderbridge short changed to open
- (in symbol TitleBlock) Revision; Title; Sheet Name; Sheet; of; Date; Drawn By; Number; Aprvd By; 6500 River Place Boulevard / Building 7, Suite 200 / Austin, TX 78730 / +1 (512) 879-2850; This document contains information proprietary to Ambiq and shall not be used, reproduced, or disclosed to others, / in part or in whole, without express written permission from Ambiq.

## Library data of the parts
? = TitleBlock: Title block for Ambiq Schematics. Please have the following parameters entered in Project>Project Options>Parameters: / TBTitle / TBDocumentNumber / TBRevision / TBDrawnBy / TBApprovedBy; AMBIQ PN: TitleBlock